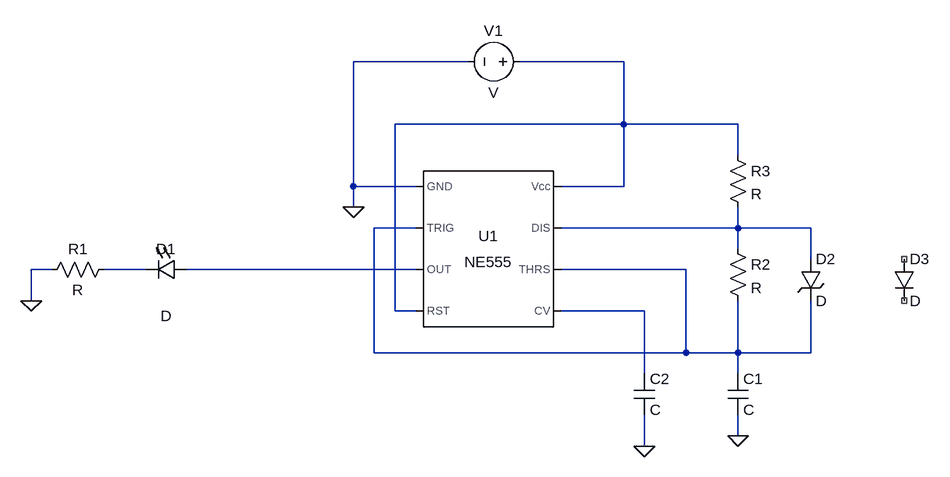
[diagram p0: schematic Draft4.asc]
Draft4.asc, the LTspice schematic file:
Version 4.1
SHEET 1 924 680
WIRE 208 -128 32 -128
WIRE 448 -128 288 -128
WIRE 448 -32 448 -128
WIRE 448 -32 96 -32
WIRE 624 -32 448 -32
WIRE 624 16 624 -32
WIRE 32 64 32 -128
WIRE 128 64 32 64
WIRE 448 64 448 -32
WIRE 448 64 352 64
WIRE 32 96 32 64
WIRE 128 128 64 128
WIRE 624 128 624 96
WIRE 624 128 352 128
WIRE 736 128 624 128
WIRE 624 160 624 128
WIRE 736 176 736 128
WIRE -432 192 -464 192
WIRE -288 192 -352 192
WIRE 128 192 -224 192
WIRE 544 192 352 192
WIRE -464 240 -464 192
WIRE 96 256 96 -32
WIRE 128 256 96 256
WIRE 480 256 352 256
WIRE 64 320 64 128
WIRE 544 320 544 192
WIRE 544 320 64 320
WIRE 624 320 624 240
WIRE 624 320 544 320
WIRE 736 320 736 240
WIRE 736 320 624 320
WIRE 480 352 480 256
WIRE 624 352 624 320
WIRE 624 448 624 416
WIRE 480 464 480 416
FLAG 32 96 0
FLAG -464 240 0
FLAG 480 464 0
FLAG 624 448 0
SYMBOL Misc\\NE555 240 160 R0
SYMATTR InstName U1
SYMBOL voltage 304 -128 R90
WINDOW 0 -32 56 VBottom 2
WINDOW 3 32 56 VTop 2
SYMATTR InstName V1
SYMBOL LED -224 176 R90
WINDOW 0 0 32 VBottom 2
WINDOW 3 72 32 VTop 2
SYMATTR InstName D1
SYMBOL res -336 176 R90
WINDOW 0 0 56 VBottom 2
WINDOW 3 32 56 VTop 2
SYMATTR InstName R1
SYMBOL cap 464 352 R0
SYMATTR InstName C2
SYMBOL cap 608 352 R0
SYMATTR InstName C1
SYMBOL res 608 144 R0
SYMATTR InstName R2
SYMBOL res 608 0 R0
SYMATTR InstName R3
SYMBOL zener 720 176 R0
SYMATTR InstName D2
SYMBOL diode 864 176 R0
SYMATTR InstName D3

The netlist it stands for:
* Draft4.asc
X§U1 0 N002 N005 N001 N006 N002 N003 N001 NE555  ; pins GND TRIG OUT RST CV THRS DIS Vcc
V1 N001 0 V
D1 N005 N004 D
R1 N004 0 R
C2 N006 0 C
C1 N002 0 C
R2 N003 N002 R
R3 N001 N003 R
D2 N003 N002 D
D3 NC_01 NC_02 D
.model D D
.lib standard.dio
.lib NE555.sub
.backanno
.end